# Altium schematic sheet power_PS_v3.SchDoc
size Letter; SheetNumber: 2; SheetTotal: 2
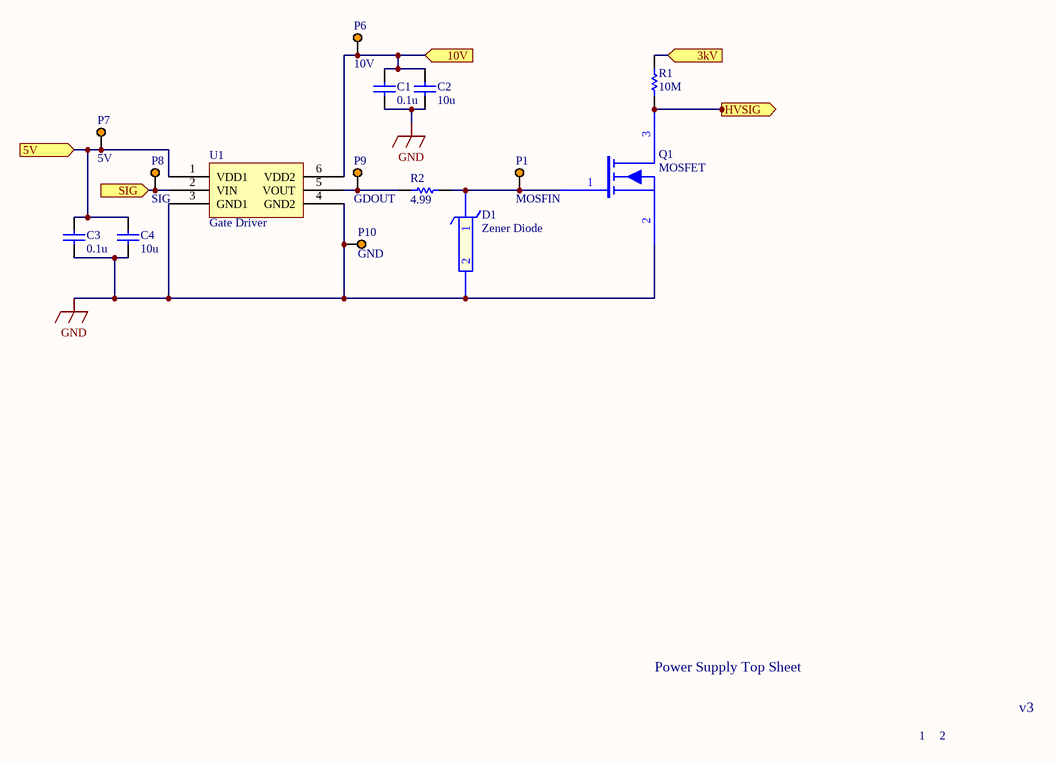
[diagram p0: power_PS_v3.SchDoc]

## Parts
C1  0.1u  [0.1uF Cer SMD]
C2  10u  [10uF Cer SMD]
C3  0.1u  [0.1uF Cer SMD]
C4  10u  [10uF Cer SMD]
D1  Zener Diode  [Zener Diode]
P1  MOSFIN  [5013]
P6  10V  [5013]
P7  5V  [5013]
P8  SIG  [5013]
P9  GDOUT  [5013]
P10  GND  [5013]
Q1  MOSFET  [MOSFET]
R1  10M  [10M Ohm]
R2  4.99  [4.99 Ohm]
U1  Gate Driver  [Gate Driver]

## Ports
3kV (in), 5V (in), 10V (in), HVSIG (out), SIG (in)

## Nets
GND: C1.1 C2.1 C3.1 C4.1 D1.2 P10.1 Q1.2(S) U1.3(GND1) U1.4(GND2)
3kV: R1.1 ; port 3kV
5V: C3.2 C4.2 P7.1 U1.1(VDD1) ; port 5V
10V: C1.2 C2.2 P6.1 U1.6(VDD2) ; port 10V
HVSIG: Q1.3(D) R1.2 ; port HVSIG
SIG: P8.1 U1.2(VIN) ; port SIG
NetD1_1: D1.1 P1.1 Q1.1(G) R2.1
NetP9_1: P9.1 R2.2 U1.5(VOUT)

## Notes on the sheet
- Power Supply Top Sheet
- 1
- 2
- v3

## Library data of the parts
C1-C4 = Capacitor
D1 = Zener Diode: KDZVTR16B; Vendor: ROHM Semiconductor; Built_By: EMA_Matt; SourceLibrary: Rohm_2019-09-23; Type: DEV; Manufacturer_Part_Number: KDZVTR16B; Copyright: Copyright (C) 2018 Accelerated Designs. All rights reserved; RefDes: RefDes
P1 P6-P10 = Output Point: Thru hole via
Q1 = MOSFET: IXTL2N4X0
R1 R2 = Resistor
U1 = Gate Driver: ADuM4120